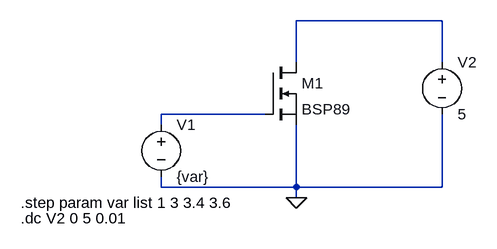
[diagram p0: schematic 2_Zadatak_lab4.asc]
2_Zadatak_lab4.asc, the LTspice schematic file:
Version 4
SHEET 1 880 680
WIRE 400 32 176 32
WIRE 176 96 176 32
WIRE 400 96 400 32
WIRE 128 176 -32 176
WIRE -32 192 -32 176
WIRE -32 288 -32 272
WIRE 176 288 176 192
WIRE 176 288 -32 288
WIRE 400 288 400 176
WIRE 400 288 176 288
WIRE 176 304 176 288
FLAG 176 304 0
SYMBOL nmos 128 96 R0
SYMATTR InstName M1
SYMATTR Value BSP89
SYMBOL voltage -32 176 R0
SYMATTR InstName V1
SYMATTR Value {var}
SYMBOL voltage 400 80 R0
SYMATTR InstName V2
SYMATTR Value 5
TEXT -248 312 Left 2 !.step param var list 1 3 3.4 3.6
TEXT -248 336 Left 2 !.dc V2 0 5 0.01

The netlist it stands for:
* 2_Zadatak_lab4.asc
M1 N001 N002 0 0 BSP89
V1 N002 0 {var}
V2 N001 0 5
.model NMOS NMOS
.model PMOS PMOS
.lib standard.mos
.step param var list 1 3 3.4 3.6
.dc V2 0 5 0.01
.backanno
.end